# EAGLE design Yayın Ders 3 (EAGLE 9.6.2)
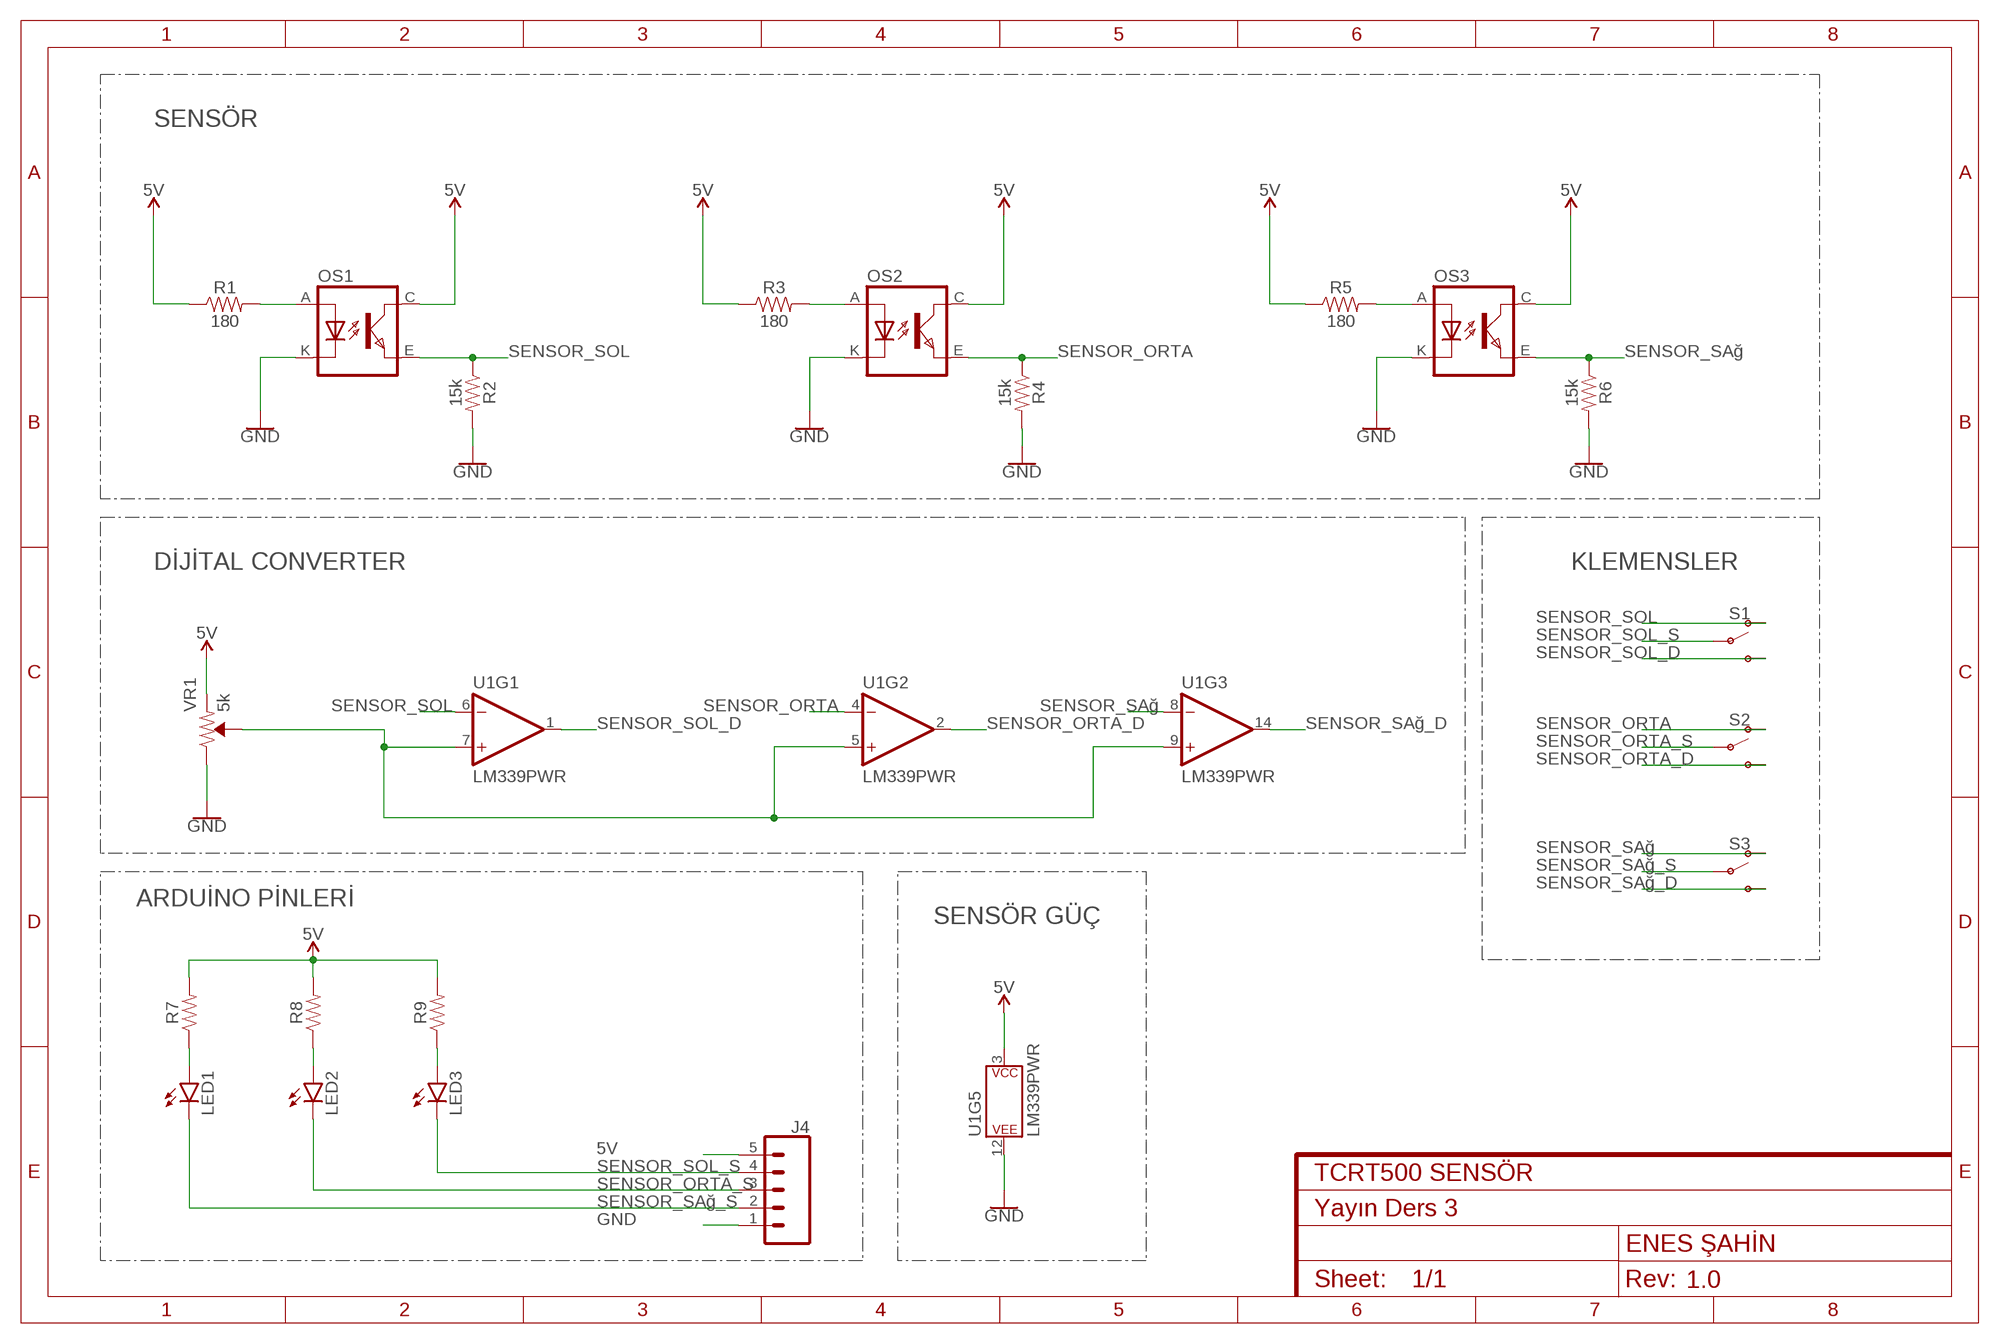
[diagram p0: schematic, sheet 1]
FRAME1 (FRAME-A4L): CNAME: TCRT500 SENSÖR; CREVISION: 1.0; DESIGNER: ENES ŞAHİN

## Parts
J4  CONN_05  [1X05]
LED1  LEDCHIP-LED0805  [CHIP-LED0805]
LED2  LEDCHIP-LED0805  [CHIP-LED0805]
LED3  LEDCHIP-LED0805  [CHIP-LED0805]
OS1  TCRT5000  [TCRT5000]
OS2  TCRT5000  [TCRT5000]
OS3  TCRT5000  [TCRT5000]
R1  180  0.75OHM-0805-1/4W-1%  [0805]
R2  15k  0.75OHM-0805-1/4W-1%  [0805]
R3  180  0.75OHM-0805-1/4W-1%  [0805]
R4  15k  0.75OHM-0805-1/4W-1%  [0805]
R5  180  0.75OHM-0805-1/4W-1%  [0805]
R6  15k  0.75OHM-0805-1/4W-1%  [0805]
R7  RESISTOR0805  [0805]
R8  RESISTOR0805  [0805]
R9  RESISTOR0805  [0805]
S1  SWITCH-SPDT-SMD-RIGHT-ANGLE  [SWITCH_SPST_SMD_A]
S2  SWITCH-SPDT-SMD-RIGHT-ANGLE  [SWITCH_SPST_SMD_A]
S3  SWITCH-SPDT-SMD-RIGHT-ANGLE  [SWITCH_SPST_SMD_A]
U1  LM339PWR  LM339  [TSSOP-14]
VR1  5k  TRIMPOT-SMD-5MM-CLOSED-1/4W-20%  [TRIMPOT-SMD-5MM]

## Nets
5V: J4.5 OS1.C(COLLECTOR) OS2.C(COLLECTOR) OS3.C(COLLECTOR) R1.1 R3.1 R5.1 R7.2 R8.2 R9.2 U1.3(P$V+) VR1.A(CCW)
GND: J4.1 OS1.K(CATHODE) OS2.K(CATHODE) OS3.K(CATHODE) R2.2 R4.2 R6.2 U1.12(P$V-) VR1.C(CW)
N$1: OS1.A(ANODE) R1.2
N$2: LED1.A R7.1
N$3: OS2.A(ANODE) R3.2
N$4: LED2.A R8.1
N$5: OS3.A(ANODE) R5.2
N$6: LED3.A R9.1
N$7: U1.5(+IN) U1.7(+IN) U1.9(+IN) VR1.B(WIPER)
SENSOR_ORTA: OS2.E(EMITTER) R4.1 S2.1(O) U1.4(-IN)
SENSOR_ORTA_D: S2.3(S) U1.2(OUT)
SENSOR_ORTA_S: J4.3 LED2.C S2.2(P)
SENSOR_SAğ: OS3.E(EMITTER) R6.1 S3.1(O) U1.8(-IN)
SENSOR_SAğ_D: S3.3(S) U1.14(OUT)
SENSOR_SAğ_S: J4.2 LED1.C S3.2(P)
SENSOR_SOL: OS1.E(EMITTER) R2.1 S1.1(O) U1.6(-IN)
SENSOR_SOL_D: S1.3(S) U1.1(OUT)
SENSOR_SOL_S: J4.4 LED3.C S1.2(P)
Unconnected: U1.10(-IN) U1.11(+IN) U1.13(OUT)

## Notes on the sheet
- SENSÖR
- DİJİTAL CONVERTER | KLEMENSLER
- ARDUİNO PİNLERİ
- SENSÖR GÜÇ

## Library data of the parts
J4 = SparkFun-Connectors:CONN_05: Multi connection point. Often used as Generic Header-pin footprint for 0.1 inch spaced/style header connections On any of the 0.1 inch spaced packages, you can populate with these: Break Away Headers - Straight <https://www.sparkfun.com/products/116> (PRT-00116) Break Away Male Headers - Right Angle <https://www.sparkfun.com/products/553> (PRT-00553) Female Headers <https://www.sparkfun.com/products/115> (PRT-00115) Break Away Headers - Machine Pin <https://www.sparkfun.com/products/117> (PRT-00117) Break Away Female Headers - Swiss Machine Pin <https://www.sparkfun.com/products/743> (PRT-00743) For SCREWTERMINALS and SPRING TERMINALS visit here: Screw Terimnals on SparkFun.com <https://www.sparkfun.com/search/results?term=Screw+Terminals> (5mm/3.5mm/2.54mm spacing) This device is also useful as a general connection point to wire up your design to another part of your project. Our various solder wires solder well into these plated through hole pads. Hook-Up Wire - Assortment (Stranded, 22 AWG) <https://www.sparkfun.com/products/11375> (PRT-11375) Hook-Up Wire - Assortment (Solid Core, 22 AWG) <https://www.sparkfun.com/products/11367> (PRT-11367) View the entire wire category on our website here <https://www.sparkfun.com/categories/141> Special notes: Molex polarized connector foot print use with SKU : PRT-08231 with associated crimp pins and housings. 1MM SMD Version SKU: PRT-10208
LED1-LED3 = led:LED: LED OSRAM: - CHIPLED LG R971, LG N971, LY N971, LG Q971, LY Q971, LO R971, LY R971 LH N974, LH R974 LS Q976, LO Q976, LY Q976 LO Q996 - Hyper CHIPLED LW Q18S LB Q993, LB Q99A, LB R99A - SideLED LS A670, LO A670, LY A670, LG A670, LP A670 LB A673, LV A673, LT A673, LW A673 LH A674 LY A675 LS A676, LA A676, LO A676, LY A676, LW A676 LS A679, LY A679, LG A679 - Hyper Micro SIDELED® LS Y876, LA Y876, LO Y876, LY Y876 LT Y87S - SmartLED LW L88C, LW L88S LB L89C, LB L89S, LG L890 LS L89K, LO L89K, LY L89K LS L896, LA L896, LO L896, LY L896 - TOPLED LS T670, LO T670, LY T670, LG T670, LP T670 LSG T670, LSP T670, LSY T670, LOP T670, LYG T670 LG T671, LOG T671, LSG T671 LB T673, LV T673, LT T673, LW T673 LH T674 LS T676, LA T676, LO T676, LY T676, LB T676, LH T676, LSB T676, LW T676 LB T67C, LV T67C, LT T67C, LS T67K, LO T67K, LY T67K, LW E67C LS E67B, LA E67B, LO E67B, LY E67B, LB E67C, LV E67C, LT E67C LW T67C LS T679, LY T679, LG T679 LS T770, LO T770, LY T770, LG T770, LP T770 LB T773, LV T773, LT T773, LW T773 LH T774 LS E675, LA E675, LY E675, LS T675 LS T776, LA T776, LO T776, LY T776, LB T776 LHGB T686 LT T68C, LB T68C - Hyper Mini TOPLED® LB M676 - Mini TOPLED Santana® LG M470 LS M47K, LO M47K, LY M47K Source: http://www.osram.convergy.de LUXEON: - LUMILED® LXK2-PW12-R00, LXK2-PW12-S00, LXK2-PW14-U00, LXK2-PW14-V00 LXK2-PM12-R00, LXK2-PM12-S00, LXK2-PM14-U00 LXK2-PE12-Q00, LXK2-PE12-R00, LXK2-PE12-S00, LXK2-PE14-T00, LXK2-PE14-U00 LXK2-PB12-K00, LXK2-PB12-L00, LXK2-PB12-M00, LXK2-PB14-N00, LXK2-PB14-P00, LXK2-PB14-Q00 LXK2-PR12-L00, LXK2-PR12-M00, LXK2-PR14-Q00, LXK2-PR14-R00 LXK2-PD12-Q00, LXK2-PD12-R00, LXK2-PD12-S00 LXK2-PH12-R00, LXK2-PH12-S00 LXK2-PL12-P00, LXK2-PL12-Q00, LXK2-PL12-R00 Source: www.luxeon.com KINGBRIGHT: KA-3528ASYC Source: www.kingbright.com
OS1-OS3 = tcrt5000:TCRT5000
R1-R6 = SparkFun-Resistors:0.75OHM: 0.75Ω resistor A resistor is a passive two-terminal electrical component that implements electrical resistance as a circuit element. Resistors act to reduce current flow, and, at the same time, act to lower voltage levels within circuits. - Wikipedia; PROD_ID: RES-08474; VALUE: 0.75
R7-R9 = SparkFun-Resistors:RESISTOR: Generic Resistor Package
S1-S3 = SparkFun-Switches:SWITCH-SPDT: Single Pole, Double Throw (SPDT) Switch Single-pole, double-throw (SPDT) switch. Variant Overview SMD-AYZ0202 Surface Mount DPDT Switch <https://www.sparkfun.com/products/597> (COM-00597) Used on e.g. LilyPad Arduino USB - ATmega32U4 Board <https://www.sparkfun.com/products/12049> PTH-11.6X4.0MM SPDT Mini Power Switch <https://www.sparkfun.com/products/102> (COM-00102) Used on e.g. SparkFun Simon Says - Through-Hole Soldering Kit <https://www.sparkfun.com/products/10547> (KIT-10547) PTH-11.6X4.0MM-KIT KIT version of SPDT Mini Power Switch - Simplifies soldering by removing tStop of switch pins - only one side can be soldered. PTH-11.6X4.0MM-LOCK LOCK version of SPDT Mini Power Switch - Offset pins hold switch in place for easier soldering. SMD-RIGHT-ANGLE Surface Mount Right Angle Switch <https://www.sparkfun.com/products/10860> (COM-10860) Used on e.g. SparkFun ESP8266 Thing <https://www.sparkfun.com/products/13231>; PROD_ID: SWCH-10651; SF_SKU: COM-10860
U1 = SparkFun-IC-Amplifiers:LM339: Quad Comparator - LM339PWR Based on information from the SLCS006N datasheet from TI (www.ti.com). Created by nick@scantool.net, 2008. Updated 2016. SparkFun Products SparkFun OBD-II UART <https://www.sparkfun.com/products/9555> (WIG-09555) SparkFun Car Diagnostics Kit <https://www.sparkfun.com/products/10769> (RTL-10769); PROD_ID: IC-09990
VR1 = SparkFun-Resistors:TRIMPOT: Trimming Potentiometer (Trimpot) Three-terminal potentiometers, with an adjustable wiper and two adjustable resistors. A pot can be used to create a configurable voltage divider, or as a variable resistor. "Trimpots" are a subset of potentiometers, usually intended for "set-and-forget" applications. They're often more delicate than standard potentiometers - rated for fewer turns. Variants PTH-KNOB - PTH Trimpot w/ finger-adjustable knob Trimpot 10K with Knob <https://www.sparkfun.com/products/9806> (COM-09806) Datasheet <http://www.sparkfun.com/datasheets/Components/General/TSR-3386.pdf> SMD-3MM-CLOSED-FRAME - SMD 3mm Square Closed-Frame Trimpot Used on e.g. EasyDriver - Stepper Motor Driver <https://www.sparkfun.com/products/12779> Datasheet <http://www.bitechnologies.com/pdfs/22.pdf> (22AR10KTR) SMD-5MM - SMD 5mm Square Closed-Frame Trimpot Used on e.g. IOIO-OTG - V2.2 <https://www.sparkfun.com/products/13613> Datasheet <http://www.vishay.com/docs/51008/ts53.pdf> (TS53YL502MR10) SMD-3MM-1/10W-25% - 3mm Square Open-Frame Trimpot Used on e.g. SparkFun Shapeoko <https://www.sparkfun.com/products/13899> Datasheet <http://www.bourns.com/docs/Product-Datasheets/TC33.pdf> (TC33X-2-103E); PROD_ID: RES-11156

## Board
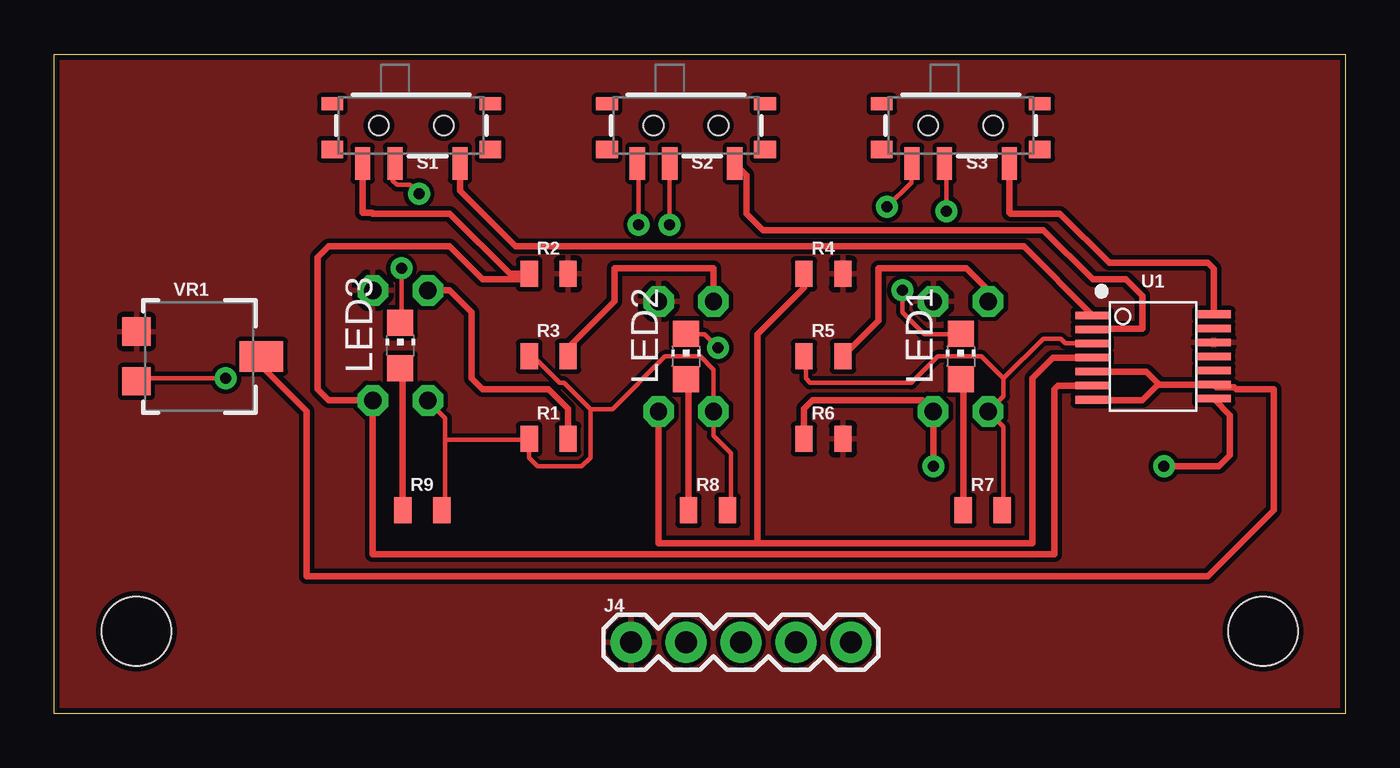
[diagram p1: board, top side]
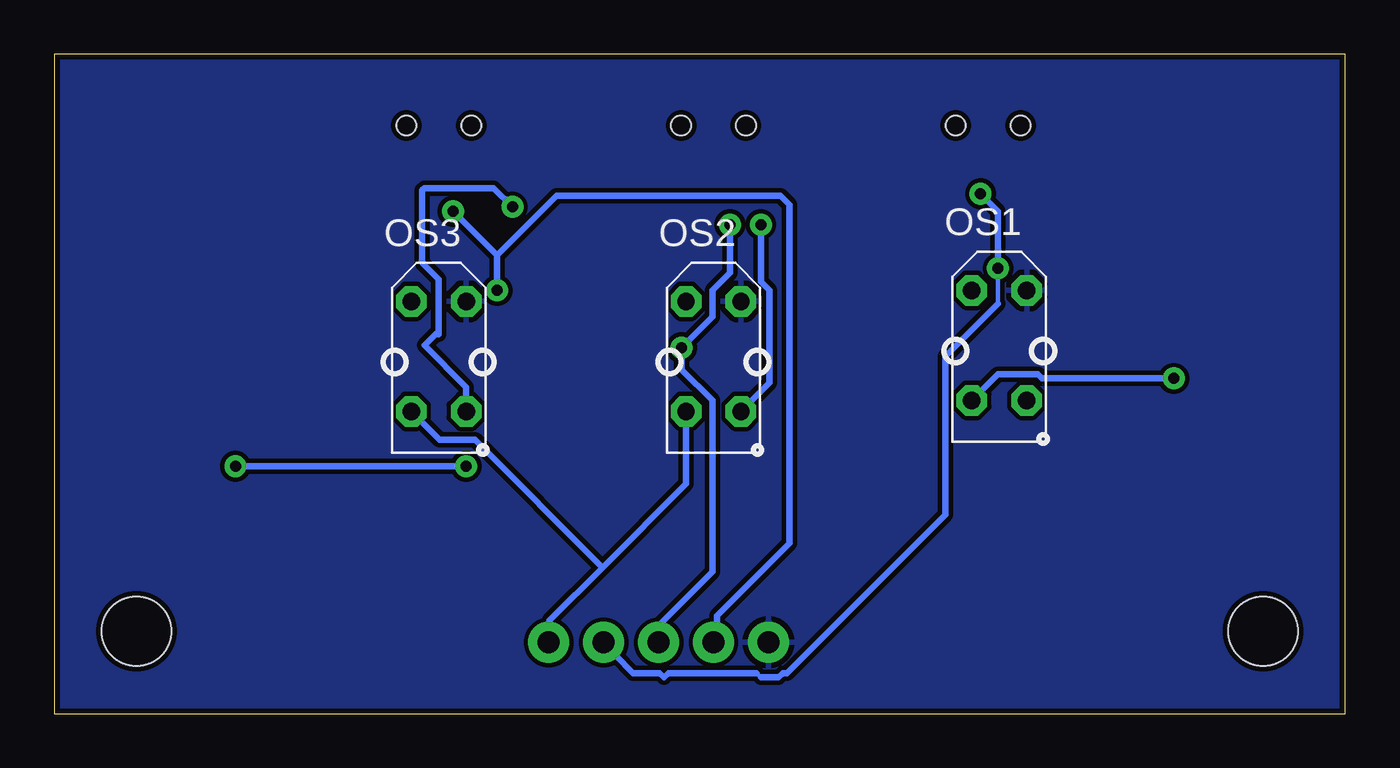
[diagram p2: board, bottom side, seen from below]

Size 59.69 x 30.48 mm. Coordinates in mm from the lower left corner, seen from the top.
Outline: 3.81,30.48 59.69,30.48 59.69,0 0,0 0,30.48 3.81,30.48
Copper layers (1*16): Top 0.035mm / dielectric 1.5mm / Bottom 0.035mm
Design rules "SparkFun": minimum track width 8mil, minimum drill 20mil, track to track 8mil, track to pad 8mil, pad to pad 8mil, via to via 8mil, smd to smd 8mil, copper to edge 10mil, drill to drill 8mil, minimum pad ring 12mil, minimum via ring 10mil, stop-mask expansion 4mil, vias tented up to drill 25mil, thermal gap 10mil
Holes 3.2 mm at 3.81,3.81 55.88,3.81

### Footprints (pad centres in the part's own frame; a part is rotated, then mirrored left to right if it is on the bottom)
1X05 = drill 1.016 pad 1.88: 1 0,0; 2 2.54,0; 3 5.08,0; 4 7.62,0; 5 10.16,0
CHIP-LED0805 = smd 1.2 x 1.2: A 0,-1.05; C 0,1.05
TCRT5000 = drill 0.8 octagon: A -2.54,-1.27; C 2.54,-1.27; E 2.54,1.27; K -2.54,1.27
0805 = smd 0.8 x 1.2: 1 -0.9,0; 2 0.9,0
SWITCH_SPST_SMD_A = smd 0.7 x 1.5: 1 -2.25,-1.75; 2 -0.75,-1.75; 3 2.25,-1.75 | smd 1 x 0.6: GND1 -3.65,1; GND3 3.65,1 | smd 1 x 0.8: GND2 -3.65,-1.1; GND4 3.65,-1.1 | hole 0.9: -1.5,0; 1.5,0
TSSOP-14 = smd 1.6 x 0.35: 1 -2.8,1.9; 2 -2.8,1.25; 3 -2.8,0.6; 4 -2.8,-0.05; 5 -2.8,-0.7; 6 -2.8,-1.35; 7 -2.8,-2; 8 2.8,-1.95; 9 2.8,-1.3; 10 2.8,-0.65; 11 2.8,0; 12 2.8,0.65; 13 2.8,1.3; 14 2.8,1.95
TRIMPOT-SMD-5MM = smd 1.3 x 1.3: A 1.15,-2.54; C -1.15,-2.54 | smd 1.402 x 2: B 0,3.239

### Placement (x,y rotation side)
J4  26.67,3.3 0 top
LED1  41.91,16.51 0 top
LED2  29.21,16.51 0 top
LED3  16,17.02 0 top
OS1  16,17.02 270 bottom
OS2  29.21,16.51 270 bottom
OS3  41.91,16.51 270 bottom
R1  22.86,12.7 0 top
R2  22.86,20.32 0 top
R3  22.86,16.51 0 top
R4  35.56,20.32 0 top
R5  35.56,16.51 0 top
R6  35.56,12.7 0 top
R7  42.93,9.4 0 top
R8  30.23,9.4 0 top
R9  17.02,9.4 0 top
S1  16.51,27.18 0 top
S2  29.21,27.18 0 top
S3  41.91,27.18 0 top
U1  50.8,16.51 0 top
VR1  6.35,16.51 270 top

### Tracks (layer width: path | path; a pad name or v marks a point on that pad's centre or on a via)
5V  (via drill 0.51)
  Top 0.203: 18.09,12.65 18.09,13.67 OS1.C | 18.09,12.65 18.09,9.4 R9.2 | 18.09,12.65 21.95,12.65 | 24.79,14.07 23.57,15.29 23.37,15.29 22.15,16.51 R3.1 | 24.79,14.07 24.79,11.84 24.38,11.43 22.35,11.43 21.95,11.84 21.95,12.65 | 21.95,12.65 R1.1 | v7.92,15.49 3.86,15.49 VR1.A | 43.89,15.49 42.88,16.51 40.84,16.51 39.62,15.29 34.95,15.29 34.75,15.49 34.75,16.51 R5.1 | 43.89,15.49 43.89,14.68 OS3.C 43.89,13.26 43.89,9.4 R7.2 | 43.89,15.49 45.72,17.32 46.53,17.32 46.74,17.12 47.95,17.12 U1.3 | R8.2 31.29,9.4 31.29,12.04 30.48,12.85 OS2.C 30.48,15.9 29.87,16.51 28.25,16.51 25.81,14.07 24.79,14.07
  Bottom 0.203: 36.78,3.3 J4.5
  Bottom 0.305: v7.92,15.49 14.02,15.49 14.22,15.7 16.05,15.7 OS1.C | 36.78,3.3 36.78,4.32 34.34,6.76 | 34.34,6.76 30.48,10.62 OS2.C | OS3.C 41.86,12.65 40.23,12.65 34.34,6.76
GND
  pour Top: 8.89,17.78 31.75,17.78 31.75,5.08 8.89,5.08
  pour Top: 1.27,30.48 59.69,30.48 59.69,0 -1.27,0 -1.27,30.48
  pour Bottom: 1.27,30.48 59.69,30.48 59.69,0 0,0 0,30.48
N$1
  Top 0.305: R1.2 23.76,14.09 22.86,14.99 19.81,14.99 19.3,15.49 19.3,18.54 18.29,19.56 OS1.A
N$2
  Top 0.305: R7.1 42.03,15.34 LED1.A
N$3
  Top 0.305: R3.2 23.76,16.9 25.91,19.05 25.91,20.57 30.48,20.57 OS2.A
N$4
  Top 0.305: R8.1 29.33,15.34 LED2.A
N$5
  Top 0.305: R5.2 38.1,18.15 38.1,20.57 42.16,20.57 43.18,19.56 OS3.A
N$6
  Top 0.305: R9.1 16.12,15.85 LED3.A
N$7
  Top 0.305: VR1.B 9.59,16.07 11.68,13.97 11.68,6.35 53.34,6.35 56.39,9.4 56.39,14.99 54.65,14.99 54.55,15.09 53.72,15.09 U1.9 51.02,15.21 | U1.7 48.03,14.48 50.29,14.48 51.02,15.21 | U1.5 50.48,15.81 51.02,15.27 51.02,15.21
SENSOR_ORTA  (via drill 0.51)
  Top 0.203: v27.03,22.61 27.03,25.35 S2.1
  Top 0.305: U1.4 46.18,16.46 45.21,15.49 45.21,7.87 32.51,7.87 | 32.51,7.87 27.94,7.87 OS2.E | R4.1 34.66,19.67 32.51,17.53 32.51,7.87 | S2.1 26.92,25.39
  Bottom 0.305: v27.03,22.61 27.03,19.96 26.62,19.56 26.62,15.29 OS2.E
SENSOR_ORTA_D
  Top 0.305: U1.2 48.02,17.78 50.29,17.78 50.29,19.3 49.53,20.07 48.01,20.07 45.72,22.35 32.77,22.35 32,23.11 32,24.88 S2.3
SENSOR_ORTA_S  (via drill 0.51)
  Top 0.203: v30.68,16.92 30.07,17.53 29.26,17.53 LED2.C | v28.45,22.61 28.45,25.35 S2.2
  Top 0.305: S2.2 28.45,25.42
  Bottom 0.203: 31.7,3.3 J4.3
  Bottom 0.305: 31.7,3.3 31.7,4.12 29.26,6.55 29.26,14.48 30.68,15.9 v30.68,16.92 29.26,18.34 29.26,19.56 28.45,20.37 v28.45,22.61
SENSOR_SAğ  (via drill 0.51)
  Top 0.203: v38.51,23.42 39.62,24.54 39.62,25.35 S3.1
  Top 0.305: U1.8 54.36,13.8 54.36,11.94 53.85,11.43 v51.31,11.43 | v40.64,11.43 OS3.E 40.13,14.48 35.05,14.48 34.66,14.09 R6.1
  Bottom 0.305: v51.31,11.43 v40.64,11.43 | v38.51,23.42 39.37,24.28 42.57,24.28 42.67,24.18 42.67,20.83 41.91,20.07 41.91,17.53 42.06,17.53 42.57,17.02 40.64,15.09 OS3.E
SENSOR_SAğ_D
  Top 0.305: U1.14 53.6,20.57 53.34,20.83 48.77,20.83 46.48,23.11 44.2,23.11 44.16,23.15 S3.3
SENSOR_SAğ_S  (via drill 0.51)
  Top 0.203: v39.22,19.56 39.22,18.54 40.23,17.53 41.86,17.53 LED1.C | v41.25,23.22 41.25,25.35 S3.2
  Bottom 0.203: 29.06,3.3 J4.2
  Bottom 0.305: 39.22,21.18 v39.22,19.56 | v41.25,23.22 39.22,21.18 | 29.06,3.3 29.06,4.52 25.7,7.87 25.7,23.52 26.11,23.93 36.47,23.93 39.22,21.18
SENSOR_SOL
  Top 0.305: U1.6 46.4,15.16 46.23,14.99 46.23,7.37 14.73,7.37 OS1.E 12.7,14.48 12.19,14.99 12.19,21.08 12.7,21.59 18.29,21.59 19.81,20.07 21.71,20.07 R2.1 21.08,20.32 18.29,23.11 14.73,23.11 14.7,23.15 14.26,23.15 S1.1
SENSOR_SOL_D
  Top 0.305: U1.1 44.82,21.59 21.34,21.59 18.76,24.17 S1.3
SENSOR_SOL_S  (via drill 0.51)
  Top 0.203: v16.05,20.57 16.05,18.14 LED3.C | v16.87,24.03 16.46,24.44 15.85,24.44 15.65,24.64 15.65,25.35 S1.2
  Bottom 0.203: 33.73,2.69 33.73,2.9 34.14,3.3 J4.4 | 27.03,1.68 27.23,1.88 | v16.05,20.57 16.05,18.95
  Bottom 0.305: v16.05,20.57 16.05,23.22 v16.87,24.03 | 33.73,2.69 32.92,1.88 31.7,1.88 31.5,1.68 31.29,1.88 27.23,1.88 | 27.03,1.68 26.21,1.68 26.01,1.88 25.81,1.88 18.49,9.2 18.49,16.51 16.05,18.95